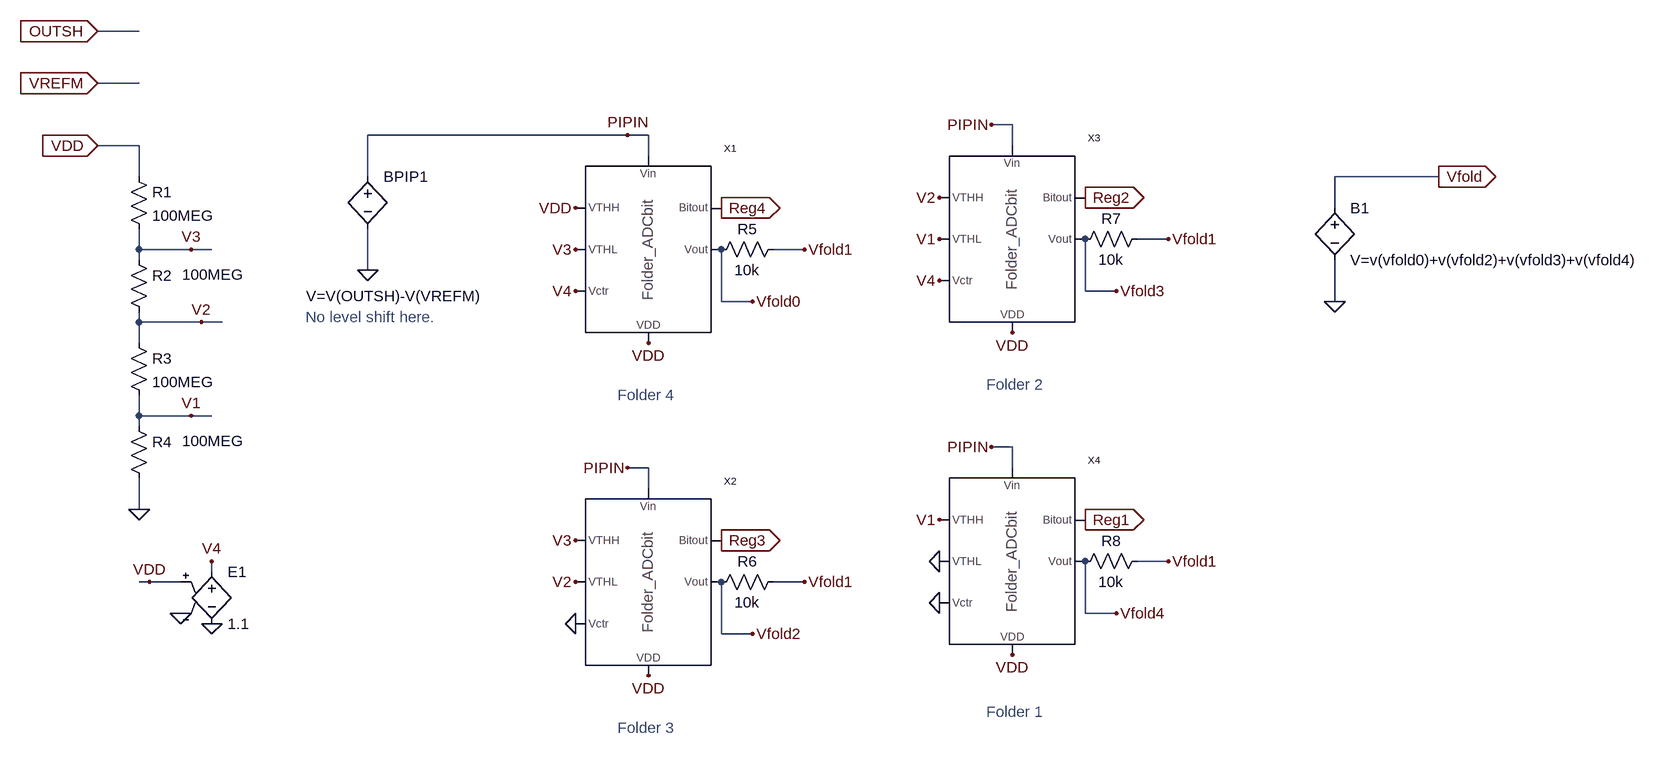
[diagram p0: schematic 2bit_folder.asc]
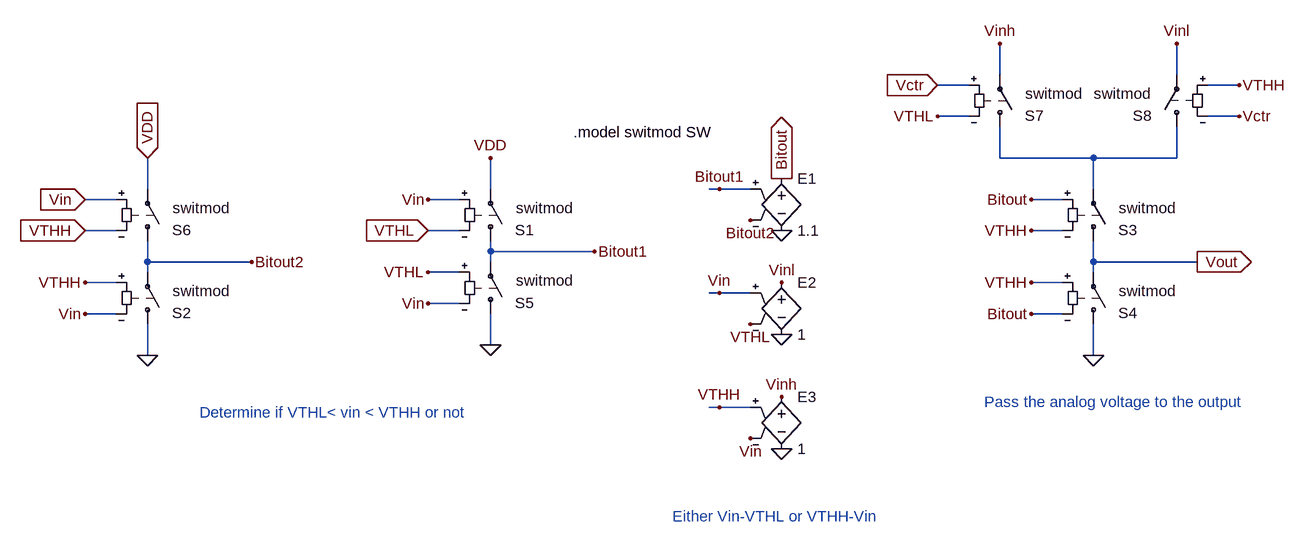
[diagram p1: sub-circuit folder_adcbit.asc]
2bit_folder.asc, the LTspice schematic file:
Version 4
SHEET 1 880 680
WIRE -1984 -1616 -2048 -1616
WIRE -1984 -1536 -2048 -1536
WIRE -640 -1472 -672 -1472
WIRE -1232 -1456 -1632 -1456
WIRE -1200 -1456 -1232 -1456
WIRE -1984 -1440 -2048 -1440
WIRE -640 -1440 -640 -1472
WIRE -1200 -1424 -1200 -1456
WIRE -1984 -1392 -1984 -1440
WIRE -1632 -1392 -1632 -1456
WIRE 16 -1392 -144 -1392
WIRE -144 -1344 -144 -1392
WIRE -400 -1296 -448 -1296
WIRE -1984 -1280 -1984 -1312
WIRE -1904 -1280 -1984 -1280
WIRE -1872 -1280 -1904 -1280
WIRE -960 -1280 -1008 -1280
WIRE -1984 -1264 -1984 -1280
WIRE -1632 -1248 -1632 -1312
WIRE -528 -1216 -528 -1296
WIRE -480 -1216 -528 -1216
WIRE -1088 -1200 -1088 -1280
WIRE -1040 -1200 -1088 -1200
WIRE -144 -1200 -144 -1264
WIRE -1984 -1168 -1984 -1184
WIRE -1888 -1168 -1984 -1168
WIRE -1856 -1168 -1888 -1168
WIRE -1984 -1136 -1984 -1168
WIRE -1984 -1024 -1984 -1056
WIRE -1904 -1024 -1984 -1024
WIRE -1872 -1024 -1904 -1024
WIRE -1984 -1008 -1984 -1024
WIRE -640 -976 -672 -976
WIRE -1200 -944 -1232 -944
WIRE -640 -944 -640 -976
WIRE -1200 -912 -1200 -944
WIRE -1984 -880 -1984 -928
WIRE -400 -800 -448 -800
WIRE -1872 -784 -1872 -800
WIRE -1968 -768 -1984 -768
WIRE -1920 -768 -1968 -768
WIRE -960 -768 -1008 -768
WIRE -528 -720 -528 -800
WIRE -480 -720 -528 -720
WIRE -1088 -688 -1088 -768
WIRE -1040 -688 -1088 -688
FLAG -1984 -880 0
FLAG -2048 -1440 VDD
IOPIN -2048 -1440 In
FLAG -1632 -1248 0
FLAG -1312 -1280 V3
FLAG -1312 -1344 VDD
FLAG -1232 -1456 PIPIN
FLAG -1904 -1280 V3
FLAG -1200 -1136 VDD
FLAG -1312 -1216 V4
FLAG -1872 -704 0
FLAG -1872 -800 V4
FLAG -1920 -720 0
FLAG -1968 -768 VDD
FLAG -2048 -1536 VREFM
IOPIN -2048 -1536 In
FLAG -2048 -1616 OUTSH
IOPIN -2048 -1616 In
FLAG -1088 -1344 Reg4
IOPIN -1088 -1344 Out
FLAG -1040 -1200 Vfold0
FLAG -144 -1200 0
FLAG 16 -1392 Vfold
IOPIN 16 -1392 Out
FLAG -1312 -768 V2
FLAG -1312 -832 V3
FLAG -1232 -944 PIPIN
FLAG -1200 -624 VDD
FLAG -1312 -704 0
FLAG -1088 -832 Reg3
IOPIN -1088 -832 Out
FLAG -1040 -688 Vfold2
FLAG -960 -1280 Vfold1
FLAG -960 -768 Vfold1
FLAG -752 -1296 V1
FLAG -752 -1360 V2
FLAG -672 -1472 PIPIN
FLAG -640 -1152 VDD
FLAG -752 -1232 V4
FLAG -528 -1360 Reg2
IOPIN -528 -1360 Out
FLAG -480 -1216 Vfold3
FLAG -400 -1296 Vfold1
FLAG -752 -800 0
FLAG -752 -864 V1
FLAG -672 -976 PIPIN
FLAG -640 -656 VDD
FLAG -752 -736 0
FLAG -528 -864 Reg1
IOPIN -528 -864 Out
FLAG -480 -720 Vfold4
FLAG -400 -800 Vfold1
FLAG -1904 -1024 V1
FLAG -1888 -1168 V2
SYMBOL res -2000 -1408 R0
SYMATTR InstName R1
SYMATTR Value 100MEG
SYMBOL bv -1632 -1408 R0
WINDOW 3 -95 200 Left 0
SYMATTR Value V=V(OUTSH)-V(VREFM)
SYMATTR InstName BPIP1
SYMBOL res -2000 -1280 R0
WINDOW 3 82 39 Left 0
SYMATTR Value 100MEG
SYMATTR InstName R2
SYMBOL Folder_ADCbit -1344 -1312 R0
SYMATTR InstName X1
SYMBOL res -992 -1296 R90
WINDOW 0 0 56 VBottom 0
WINDOW 3 32 56 VTop 0
SYMATTR InstName R5
SYMATTR Value 10k
SYMBOL e -1872 -800 R0
SYMATTR InstName E1
SYMATTR Value 1.1
SYMBOL bv -144 -1360 R0
SYMATTR InstName B1
SYMATTR Value V=v(vfold0)+v(vfold2)+v(vfold3)+v(vfold4)
SYMBOL Folder_ADCbit -1344 -800 R0
SYMATTR InstName X2
SYMBOL res -992 -784 R90
WINDOW 0 0 56 VBottom 0
WINDOW 3 32 56 VTop 0
SYMATTR InstName R6
SYMATTR Value 10k
SYMBOL Folder_ADCbit -784 -1328 R0
SYMATTR InstName X3
SYMBOL res -432 -1312 R90
WINDOW 0 0 56 VBottom 0
WINDOW 3 32 56 VTop 0
SYMATTR InstName R7
SYMATTR Value 10k
SYMBOL Folder_ADCbit -784 -832 R0
SYMATTR InstName X4
SYMBOL res -432 -816 R90
WINDOW 0 0 56 VBottom 0
WINDOW 3 32 56 VTop 0
SYMATTR InstName R8
SYMATTR Value 10k
SYMBOL res -2000 -1152 R0
SYMATTR InstName R3
SYMATTR Value 100MEG
SYMBOL res -2000 -1024 R0
WINDOW 3 82 39 Left 0
SYMATTR Value 100MEG
SYMATTR InstName R4
TEXT -1728 -1176 Left 0 ;No level shift here.
TEXT -1248 -1056 Left 0 ;Folder 4
TEXT -680 -1072 Left 0 ;Folder 2
TEXT -680 -568 Left 0 ;Folder 1
TEXT -1248 -544 Left 0 ;Folder 3

folder_adcbit.asc, the sub-circuit schematic file:
Version 4
SHEET 1 880 680
WIRE 32 -224 32 -272
WIRE 304 -224 304 -272
WIRE -16 -208 -64 -208
WIRE 400 -208 352 -208
WIRE -16 -160 -64 -160
WIRE 400 -160 352 -160
WIRE 32 -96 32 -144
WIRE 176 -96 32 -96
WIRE 304 -96 304 -144
WIRE 304 -96 176 -96
WIRE -1280 -48 -1280 -96
WIRE -752 -48 -752 -96
WIRE -400 -48 -416 -48
WIRE -352 -48 -400 -48
WIRE 176 -48 176 -96
WIRE -1328 -32 -1376 -32
WIRE -800 -32 -848 -32
WIRE 128 -32 80 -32
WIRE -1328 16 -1376 16
WIRE -800 16 -848 16
WIRE 128 16 80 16
WIRE -752 48 -752 32
WIRE -592 48 -752 48
WIRE -1280 64 -1280 32
WIRE -1120 64 -1280 64
WIRE -752 64 -752 48
WIRE 176 64 176 32
WIRE 336 64 176 64
WIRE -1280 80 -1280 64
WIRE -800 80 -848 80
WIRE 176 80 176 64
WIRE -1328 96 -1376 96
WIRE 128 96 80 96
WIRE -400 112 -416 112
WIRE -352 112 -400 112
WIRE -800 128 -848 128
WIRE -1328 144 -1376 144
WIRE 128 144 80 144
WIRE -752 192 -752 144
WIRE -1280 208 -1280 160
WIRE 176 208 176 160
WIRE -400 288 -416 288
WIRE -352 288 -400 288
FLAG -848 -32 Vin
FLAG -848 16 VTHL
IOPIN -848 16 In
FLAG -1376 96 VTHH
FLAG -1376 144 Vin
FLAG -1120 64 Bitout2
FLAG -1280 208 0
FLAG -752 -96 VDD
FLAG 80 -32 Bitout
FLAG 80 16 VTHH
FLAG 80 96 VTHH
FLAG 80 144 Bitout
FLAG 336 64 Vout
IOPIN 336 64 Out
FLAG -304 16 0
FLAG -304 176 0
FLAG -304 -64 Bitout
IOPIN -304 -64 Out
FLAG -304 96 Vinl
FLAG -352 160 VTHL
FLAG -352 0 Bitout2
FLAG -400 -48 Bitout1
FLAG -400 112 Vin
FLAG -848 80 VTHL
FLAG -848 128 Vin
FLAG -592 48 Bitout1
FLAG -752 192 0
FLAG -1376 -32 Vin
IOPIN -1376 -32 In
FLAG -1376 16 VTHH
IOPIN -1376 16 In
FLAG -1280 -96 VDD
IOPIN -1280 -96 In
FLAG 176 208 0
FLAG -304 352 0
FLAG -304 272 Vinh
FLAG -352 336 Vin
FLAG -400 288 VTHH
FLAG -64 -208 Vctr
IOPIN -64 -208 In
FLAG -64 -160 VTHL
FLAG 32 -272 Vinh
FLAG 400 -208 VTHH
FLAG 400 -160 Vctr
FLAG 304 -272 Vinl
SYMBOL sw -752 48 M180
WINDOW 3 24 -12 Left 0
WINDOW 38 39 67 Left 0
WINDOW 0 38 33 Left 0
SYMATTR Value ""
SYMATTR SpiceModel switmod
SYMATTR InstName S1
SYMBOL sw -1280 176 M180
WINDOW 3 24 -12 Left 0
WINDOW 38 39 67 Left 0
WINDOW 0 38 33 Left 0
SYMATTR Value ""
SYMATTR SpiceModel switmod
SYMATTR InstName S2
SYMBOL sw 176 48 M180
WINDOW 3 24 -12 Left 0
WINDOW 38 39 67 Left 0
WINDOW 0 38 33 Left 0
SYMATTR Value ""
SYMATTR SpiceModel switmod
SYMATTR InstName S3
SYMBOL sw 176 176 M180
WINDOW 3 24 -12 Left 0
WINDOW 38 39 67 Left 0
WINDOW 0 38 33 Left 0
SYMATTR Value ""
SYMATTR SpiceModel switmod
SYMATTR InstName S4
SYMBOL e -304 -80 R0
SYMATTR InstName E1
SYMATTR Value 1.1
SYMBOL e -304 80 R0
SYMATTR InstName E2
SYMATTR Value 1
SYMBOL sw -752 160 M180
WINDOW 3 24 -12 Left 0
WINDOW 38 39 67 Left 0
WINDOW 0 38 33 Left 0
SYMATTR Value ""
SYMATTR SpiceModel switmod
SYMATTR InstName S5
SYMBOL sw -1280 48 M180
WINDOW 3 24 -12 Left 0
WINDOW 38 39 67 Left 0
WINDOW 0 38 33 Left 0
SYMATTR Value ""
SYMATTR SpiceModel switmod
SYMATTR InstName S6
SYMBOL e -304 256 R0
SYMATTR InstName E3
SYMATTR Value 1
SYMBOL sw 32 -128 M180
WINDOW 3 24 -12 Left 0
WINDOW 38 39 67 Left 0
WINDOW 0 38 33 Left 0
SYMATTR Value ""
SYMATTR SpiceModel switmod
SYMATTR InstName S7
SYMBOL sw 304 -128 R180
WINDOW 3 24 -12 Left 0
WINDOW 38 39 67 Left 0
WINDOW 0 38 33 Left 0
SYMATTR Value ""
SYMATTR SpiceModel switmod
SYMATTR InstName S8
TEXT -1200 296 Left 0 ;Determine if VTHL< vin < VTHH or not
TEXT -472 456 Left 0 ;Either Vin-VTHL or VTHH-Vin
TEXT 8 280 Left 0 ;Pass the analog voltage to the output
TEXT -624 -136 Left 0 !.model switmod SW

The netlist it stands for:
* 2bit_folder.asc
R1 VDD V3 100MEG
BPIP1 PIPIN 0 V=V(OUTSH)-V(VREFM)
R2 V3 V2 100MEG
XX1 VDD V3 V4 PIPIN Vfold0 VDD Reg4 folder_adcbit
R5 Vfold1 Vfold0 10k
E1 V4 0 VDD 0 1.1
B1 Vfold 0 V=v(vfold0)+v(vfold2)+v(vfold3)+v(vfold4)
XX2 V3 V2 0 PIPIN Vfold2 VDD Reg3 folder_adcbit
R6 Vfold1 Vfold2 10k
XX3 V2 V1 V4 PIPIN Vfold3 VDD Reg2 folder_adcbit
R7 Vfold1 Vfold3 10k
XX4 V1 0 0 PIPIN Vfold4 VDD Reg1 folder_adcbit
R8 Vfold1 Vfold4 10k
R3 V2 V1 100MEG
R4 V1 0 100MEG

* block symbol definitions
.subckt folder_adcbit VTHH VTHL Vctr Vin Vout VDD Bitout
S1 Bitout1 VDD Vin VTHL switmod
S2 0 Bitout2 VTHH Vin switmod
S3 Vout N001 Bitout VTHH switmod
S4 0 Vout VTHH Bitout switmod
E1 Bitout 0 Bitout1 Bitout2 1.1
E2 Vinl 0 Vin VTHL 1
S5 0 Bitout1 VTHL Vin switmod
S6 Bitout2 VDD Vin VTHH switmod
E3 Vinh 0 VTHH Vin 1
S7 N001 Vinh Vctr VTHL switmod
S8 N001 Vinl VTHH Vctr switmod
* Determine if VTHL< vin < VTHH or not
* Either Vin-VTHL or VTHH-Vin
* Pass the analog voltage to the output
.model switmod SW
.ends folder_adcbit

* No level shift here.
* Folder 4
* Folder 2
* Folder 1
* Folder 3
.backanno
.end